# EAGLE design FSKube (EAGLE 6.5.0)
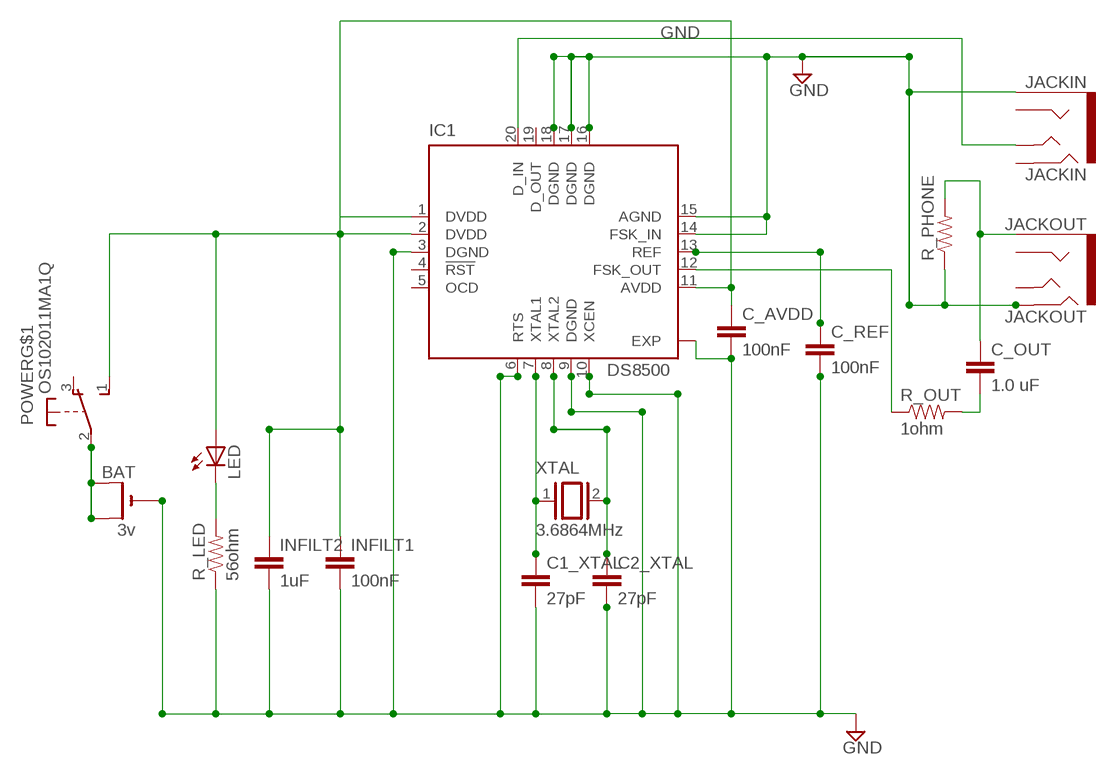
[diagram p0: schematic, sheet 1]

## Parts
BAT  3v  CR1220THM  [CR1220-THM]
C1_XTAL  27pF  C2.5/2  [C2.5-2]
C2_XTAL  27pF  C2.5/2  [C2.5-2]
C_AVDD  100nF  C2.5/2  [C2.5-2]
C_OUT  1.0 uF  C2.5/2  [C2.5-2]
C_REF  100nF  C2.5/2  [C2.5-2]
IC1  DS8500  [TQFN20-5X5]
INFILT1  100nF  C2.5/2  [C2.5-2]
INFILT2  1uF  C2.5/2  [C2.5-2]
JACKIN  JACKIN  AUDIO-JACK3  [AUDIO-JACK-TRRS-SMD]
JACKOUT  JACKOUT  AUDIO-JACK3  [AUDIO-JACK-TRRS-SMD]
LED  LED3MM  [LED3MM]
POWER  OS102011MA1Q  [OS102011MA1Q]
R_LED  56ohm  RESISTORPTH-1/6W  [1/6W-RES]
R_OUT  1ohm  RESISTORPTH-1/6W  [1/6W-RES]
R_PHONE  RESISTORPTH-1/6W  [1/6W-RES]
XTAL  3.6864MHz  XTAL/S  [QS]

## Nets
GND: BAT.- C1_XTAL.2 C2_XTAL.2 C_AVDD.2 C_REF.2 IC1.3(DGND) IC1.6(RTS) IC1.9(DGND) IC1.10(XCEN) IC1.14(FSK_IN) IC1.15(AGND) IC1.16(DGND) IC1.17(DGND) IC1.18(DGND) IC1.EXP INFILT1.2 INFILT2.2 JACKIN.EARTH JACKOUT.RING2 R_LED.1 R_PHONE.1
N$1: C1_XTAL.1 IC1.7(XTAL1) XTAL.1
N$2: C2_XTAL.1 IC1.8(XTAL2) XTAL.2
N$3: LED.K(C) R_LED.2
N$4: IC1.20(D_IN) JACKIN.TIP
N$5: BAT.+1(+) BAT.+2(+1) POWER.2(P)
N$6: IC1.12(FSK_OUT) R_OUT.1
N$8: C_REF.1 IC1.13(REF)
N$9: C_OUT.2 R_OUT.2
N$10: C_OUT.1 JACKOUT.EARTH R_PHONE.2
VDD: C_AVDD.1 IC1.1(DVDD) IC1.2(DVDD) IC1.11(AVDD) INFILT1.1 INFILT2.1 LED.A POWER.1(S)
Unconnected: IC1.4(!RST) IC1.5(OCD) IC1.19(D_OUT) JACKIN.RING1 JACKIN.RING2 JACKOUT.RING1 JACKOUT.TIP POWER.3(O) POWER.MT1(MT) POWER.MT2(MT)

## Library data of the parts
BAT = adafruit:CR1220: CR1216/CR1220/CR1225 12mm 3V lithium coin cell Great for battery packup. Both SMT and THM holders. Note the THM package has the ground pads on both sides of the PCB so that the masks are the same - this reduces the cost
C1_XTAL C2_XTAL C_AVDD C_OUT C_REF INFILT1 INFILT2 = capacitor-wima:C: CAPACITOR naming: grid - package width
IC1 = maxim:DS8500: HART Modem Single-Chip, Half-Duplex, 1200bps FSK Modulation and Demodulation Source: http://datasheets.maxim-ic.com/en/ds/DS8500.pdf; MPN: DS8500-JND+; OC_FARNELL: unknown; OC_NEWARK: 19P9102
JACKIN JACKOUT = SparkFun-Connectors:AUDIO-JACK3: Audio jack - 3.5mm TRRS variety - two rings.
LED = adafruit:LED: LED OSRAM: - CHIPLED LG R971, LG N971, LY N971, LG Q971, LY Q971, LO R971, LY R971 LH N974, LH R974 LS Q976, LO Q976, LY Q976 LO Q996 - Hyper CHIPLED LW Q18S LB Q993, LB Q99A, LB R99A - SideLED LS A670, LO A670, LY A670, LG A670, LP A670 LB A673, LV A673, LT A673, LW A673 LH A674 LY A675 LS A676, LA A676, LO A676, LY A676, LW A676 LS A679, LY A679, LG A679 - Hyper Micro SIDELED® LS Y876, LA Y876, LO Y876, LY Y876 LT Y87S - SmartLED LW L88C, LW L88S LB L89C, LB L89S, LG L890 LS L89K, LO L89K, LY L89K LS L896, LA L896, LO L896, LY L896 - TOPLED LS T670, LO T670, LY T670, LG T670, LP T670 LSG T670, LSP T670, LSY T670, LOP T670, LYG T670 LG T671, LOG T671, LSG T671 LB T673, LV T673, LT T673, LW T673 LH T674 LS T676, LA T676, LO T676, LY T676, LB T676, LH T676, LSB T676, LW T676 LB T67C, LV T67C, LT T67C, LS T67K, LO T67K, LY T67K, LW E67C LS E67B, LA E67B, LO E67B, LY E67B, LB E67C, LV E67C, LT E67C LW T67C LS T679, LY T679, LG T679 LS T770, LO T770, LY T770, LG T770, LP T770 LB T773, LV T773, LT T773, LW T773 LH T774 LS E675, LA E675, LY E675, LS T675 LS T776, LA T776, LO T776, LY T776, LB T776 LHGB T686 LT T68C, LB T68C - Hyper Mini TOPLED® LB M676 - Mini TOPLED Santana® LG M470 LS M47K, LO M47K, LY M47K Source: http://www.osram.convergy.de/
POWER = adafruit:OS102011MA1Q: OS10201MA1Q through-hole right angle switch http://www.ladyada.net/library/eagle
R_LED R_OUT R_PHONE = SparkFun-Resistors:RESISTOR: Resistor Basic schematic elements and footprints for 0603, 1206, and PTH resistors.
XTAL = special:XTAL/S: CRYSTAL

## Board
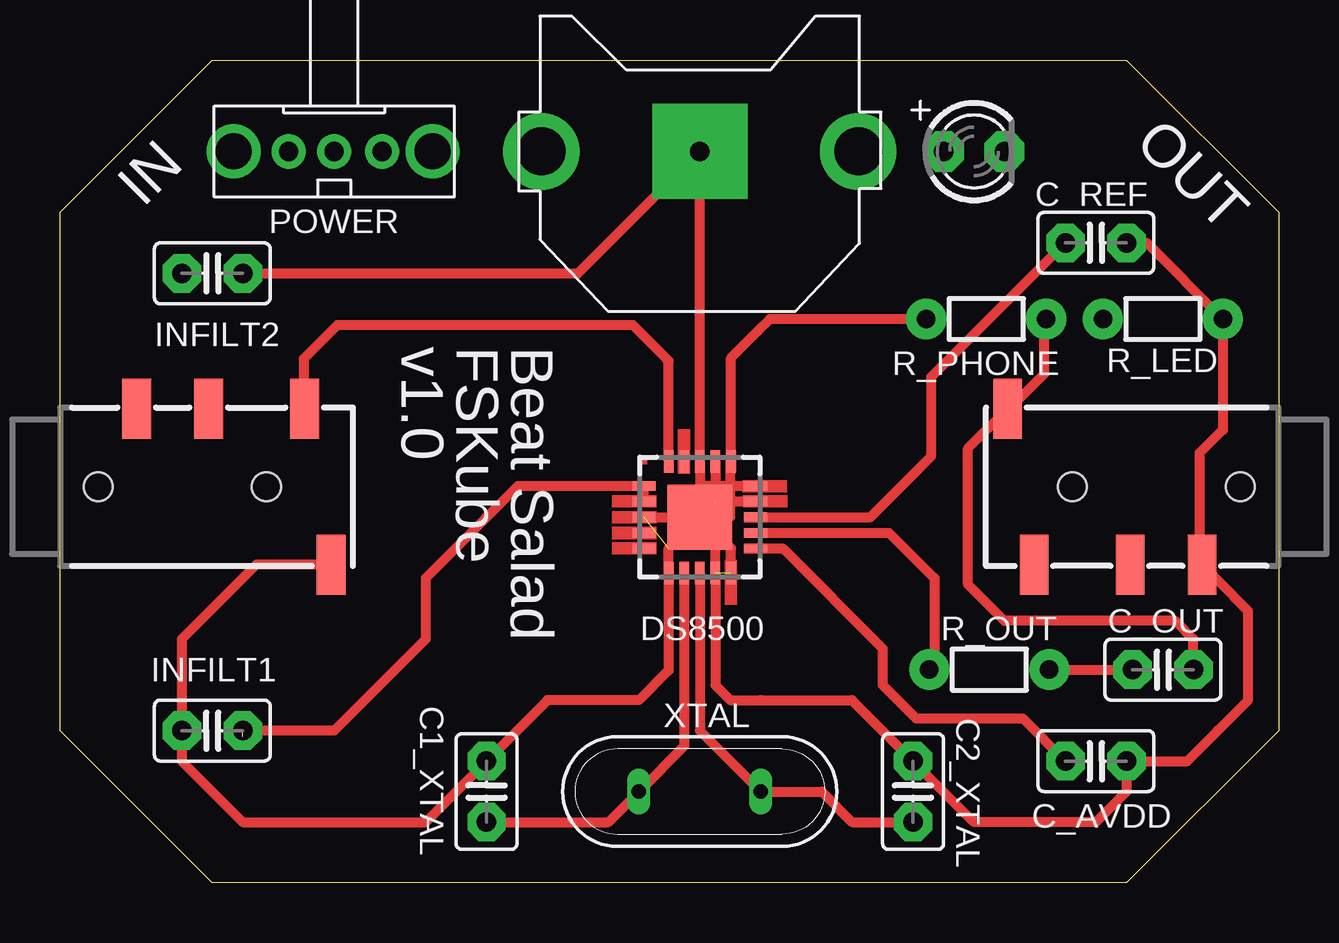
[diagram p1: board, top side]
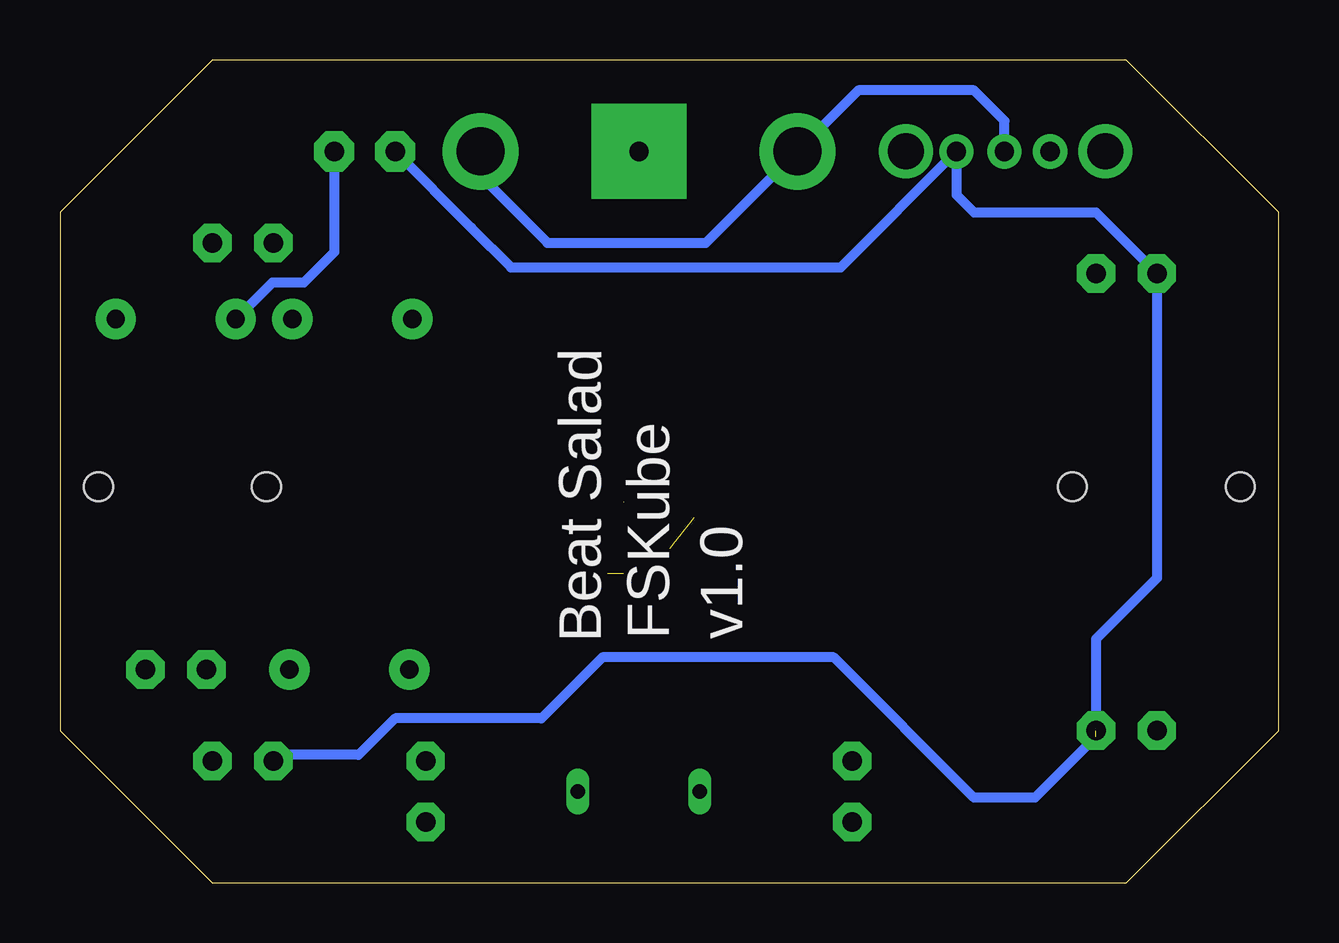
[diagram p2: board, bottom side, seen from below]

Size 50.8 x 34.29 mm. Coordinates in mm from the lower left corner, seen from the top.
Outline: 0,20.32 0,27.94 6.35,34.29 44.45,34.29 50.8,27.94 50.8,6.35 44.45,0 6.35,0 0,6.35 0,20.32
Copper layers (1*16): Top 0.0356mm / dielectric 1.5011mm / Bottom 0.0356mm
Design rules "LaenPCBOrder": minimum track width 6mil, minimum drill 13mil, track to track 6mil, track to pad 6mil, pad to pad 6mil, via to via 6mil, smd to smd 6mil, copper to edge 15mil, drill to drill 6mil, minimum pad ring 7mil, minimum via ring 7mil, stop-mask expansion 3mil, vias tented up to drill 0mil, thermal gap 10mil

### Footprints (pad centres in the part's own frame; a part is rotated, then mirrored left to right if it is on the bottom)
CR1220-THM = drill 2 pad 3.175: +1 -6.604,0; +2 6.604,0 | drill 0.8 pad 3.962 square: - 0,0
C2.5-2 = drill 0.813 pad 1.6 octagon: 1 -1.27,0; 2 1.27,0
TQFN20-5X5 = smd 0.95 x 0.4: 1 -2.325,1.3; 2 -2.325,0.65; 3 -2.325,0; 4 -2.325,-0.65; 5 -2.325,-1.3; 11 2.325,-1.3; 12 2.325,-0.65; 13 2.325,0; 14 2.325,0.65; 15 2.325,1.3 | smd 0.4 x 0.95: 6 -1.3,-2.325; 7 -0.65,-2.325; 8 0,-2.325; 9 0.65,-2.325; 10 1.3,-2.325; 16 1.3,2.325; 17 0.65,2.325; 18 0,2.325; 19 -0.65,2.325; 20 -1.3,2.325 | smd 2.7 x 2.7: EXP 0,0
AUDIO-JACK-TRRS-SMD = smd 1.2 x 2.5: EARTH 11.3,-3.25; RING1 6.2,3.25; RING2 3.2,3.25; TIP 10.2,3.25 | hole 1.2: 1.6,0; 8.6,0
LED3MM = drill 0.813 pad 1.676 octagon: A -1.27,0; K 1.27,0
OS102011MA1Q = drill 0.8 pad 1.422: 1 -2,0; 2 0,0; 3 1.9,0 | drill 1.5 pad 2.184: MT1 -4.1,0; MT2 4.2,0
1/6W-RES = drill 0.762 pad 1.676: 1 -2.5,0; 2 2.5,0
QS = drill 0.61 long: 1 -2.54,0; 2 2.54,0

### Placement (x,y rotation side)
BAT  26.67,30.48 0 top
C1_XTAL  17.78,3.81 90 top
C2_XTAL  35.56,3.81 90 top
C_AVDD  43.18,5.08 0 top
C_OUT  45.97,8.89 180 top
C_REF  43.18,26.67 0 top
IC1  26.67,15.24 0 top
INFILT1  6.35,6.35 180 top
INFILT2  6.35,25.4 0 top
JACKIN  0,16.51 0 top
JACKOUT  50.8,16.51 180 top
LED  38.1,30.48 0 top
POWER  11.43,30.48 180 top
R_LED  45.97,23.5 180 top
R_OUT  38.73,8.89 0 top
R_PHONE  38.61,23.5 0 top
XTAL  26.67,3.81 0 top

### Tracks (layer width: path | path; a pad name or v marks a point on that pad's centre or on a via)
GND  (3 unrouted)
  Top 0.254: IC1.18 26.67,17.78 26.67,29.21
  Top 0.406: IC1.3 IC1.EXP | IC1.18 26.67,16.51 | 26.67,16.51 IC1.EXP | IC1.EXP 27.32,14.59 IC1.9 27.32,8.24 27.94,7.62 29.21,7.62 33.02,7.62 C2_XTAL.2 38.1,2.54 43.18,2.54 44.45,3.81 C_AVDD.2 46.99,5.08 48.26,6.35 49.53,7.62 49.53,11.33 48.27,12.59 | INFILT2.2 21.59,25.4 BAT.- 26.67,17.78 | 11.3,12.57 JACKIN.EARTH 8.18,13.26 5.08,10.16 INFILT1.2 5.08,5.08 7.62,2.54 15.24,2.54 C1_XTAL.2 20.32,7.62 24.13,7.62 25.37,8.86 IC1.6 25.37,13.94 25.4,13.97 | 48.27,12.59 JACKOUT.RING2 | IC1.17 27.32,15.86 27.94,15.24 27.94,17.54 IC1.16 27.97,21.87 29.08,22.99 29.59,23.5 R_PHONE.1 | IC1.15 26.7,16.54 26.67,16.51 | IC1.14 27.32,15.89 IC1.EXP | IC1.10 27.97,13.94 27.94,13.97 | C_REF.2 45.3,26.67 R_LED.1 48.47,18.88 47.5,17.91 47.5,13.36 48.27,12.59
N$1
  Top 0.406: IC1.7 26.02,5.7 XTAL.1 22.86,2.54 C1_XTAL.1
N$2
  Top 0.406: IC1.8 26.67,6.35 XTAL.2 31.75,3.81 33.02,2.54 C2_XTAL.1
N$3
  Bottom 0.406: LED.K 39.37,26.29 40.64,25.02 41.95,25.02 R_LED.2
N$4
  Top 0.406: IC1.20 25.37,21.75 25.27,21.84 23.88,23.24 11.56,23.24 10.16,21.84 10.16,19.8 JACKIN.TIP
N$5
  Bottom 0.406: POWER.2 11.43,31.75 12.7,33.02 17.53,33.02 BAT.+1 23.88,26.67 30.48,26.67 33.27,29.46 BAT.+2
N$6
  Top 0.406: IC1.12 34.56,14.59 36.45,12.7 36.45,9.1 R_OUT.1
N$8
  Top 0.406: IC1.13 33.78,15.24 36.32,17.78 36.32,21.08 C_REF.1
N$9
  Top 0.406: R_OUT.2 C_OUT.2
N$10
  Top 0.406: C_OUT.1 47.24,10.16 46.48,10.92 39.37,10.92 37.85,12.45 37.85,18.11 JACKOUT.EARTH 39.57,19.76 41.02,21.21 41.02,23.41 R_PHONE.2
VDD  (1 unrouted)
  Top 0.406: 18.43,15.89 17.78,15.24 | 17.78,15.24 15.24,12.7 15.24,10.16 11.43,6.35 INFILT1.1 | 17.78,15.24 19.08,16.54 IC1.1 IC1.2 | IC1.11 30.13,13.94 34.29,9.78 34.29,8.26 35.69,6.86 40.13,6.86 C_AVDD.1
  Bottom 0.406: INFILT1.1 7.62,10.16 5.08,12.7 INFILT2.1 7.62,27.94 12.7,27.94 13.43,28.67 POWER.1 18.26,25.65 32,25.65 33.66,27.3 LED.A | 7.62,6.1 10.16,3.56 12.7,3.56 18.54,9.4 28.19,9.4 30.73,6.86 36.83,6.86 38.35,5.33 41.66,5.33 C_AVDD.1
(copper drawn outside any net)
  shapes: Top area x8

### Text on the board
tPlace: OUT | IN | v1.0 | FSKube | Beat Salad
bPlace: v1.0 | FSKube | Beat Salad